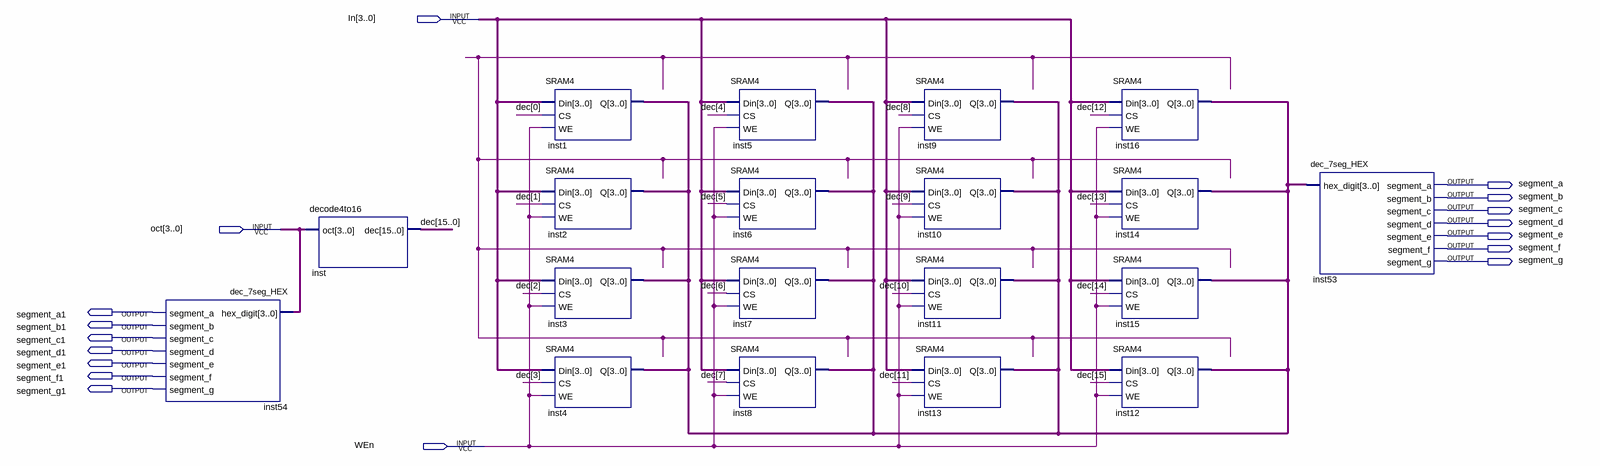
[diagram p0: schematic sheet]
// Quartus schematic 16x4_SRAM.bdf as structural Verilog: 19 symbols, 17 pins
module \16x4_SRAM  (
  input  [3:0] In,
  input  [3:0] oct,
  input  WEn,
  output segment_a,
  output segment_b,
  output segment_c,
  output segment_d,
  output segment_e,
  output segment_f,
  output segment_g,
  output segment_a1,
  output segment_b1,
  output segment_c1,
  output segment_d1,
  output segment_e1,
  output segment_f1,
  output segment_g1
);

  wire [3:0] inst1_q;
  wire [15:0] dec;

  dec_7seg_HEX inst54 (
    .hex_digit(oct), .segment_a(segment_a1), .segment_b(segment_b1), .segment_c(segment_c1),
    .segment_d(segment_d1), .segment_e(segment_e1), .segment_f(segment_f1), .segment_g(segment_g1));
  decode4to16 inst (.oct(oct), .dec(dec));
  SRAM4 inst1 (.Din(In), .CS(dec[0]), .WE(WEn), .Q(inst1_q));
  SRAM4 inst2 (.Din(In), .CS(dec[1]), .WE(WEn), .Q(inst1_q));
  SRAM4 inst3 (.Din(In), .CS(dec[2]), .WE(WEn), .Q(inst1_q));
  SRAM4 inst4 (.Din(In), .CS(dec[3]), .WE(WEn), .Q(inst1_q));
  SRAM4 inst5 (.Din(In), .CS(dec[4]), .WE(WEn), .Q(inst1_q));
  SRAM4 inst6 (.Din(In), .CS(dec[5]), .WE(WEn), .Q(inst1_q));
  SRAM4 inst7 (.Din(In), .CS(dec[6]), .WE(WEn), .Q(inst1_q));
  SRAM4 inst8 (.Din(In), .CS(dec[7]), .WE(WEn), .Q(inst1_q));
  SRAM4 inst9 (.Din(In), .CS(dec[8]), .WE(WEn), .Q(inst1_q));
  SRAM4 inst10 (.Din(In), .CS(dec[9]), .WE(WEn), .Q(inst1_q));
  SRAM4 inst11 (.Din(In), .CS(dec[10]), .WE(WEn), .Q(inst1_q));
  SRAM4 inst13 (.Din(In), .CS(dec[11]), .WE(WEn), .Q(inst1_q));
  SRAM4 inst16 (.Din(In), .CS(dec[12]), .WE(WEn), .Q(inst1_q));
  SRAM4 inst14 (.Din(In), .CS(dec[13]), .WE(WEn), .Q(inst1_q));
  SRAM4 inst15 (.Din(In), .CS(dec[14]), .WE(WEn), .Q(inst1_q));
  SRAM4 inst12 (.Din(In), .CS(dec[15]), .WE(WEn), .Q(inst1_q));
  dec_7seg_HEX inst53 (
    .hex_digit(inst1_q), .segment_a(segment_a), .segment_b(segment_b), .segment_c(segment_c),
    .segment_d(segment_d), .segment_e(segment_e), .segment_f(segment_f), .segment_g(segment_g));
endmodule
